# EAGLE schematic full_board (EAGLE 7.4.0)
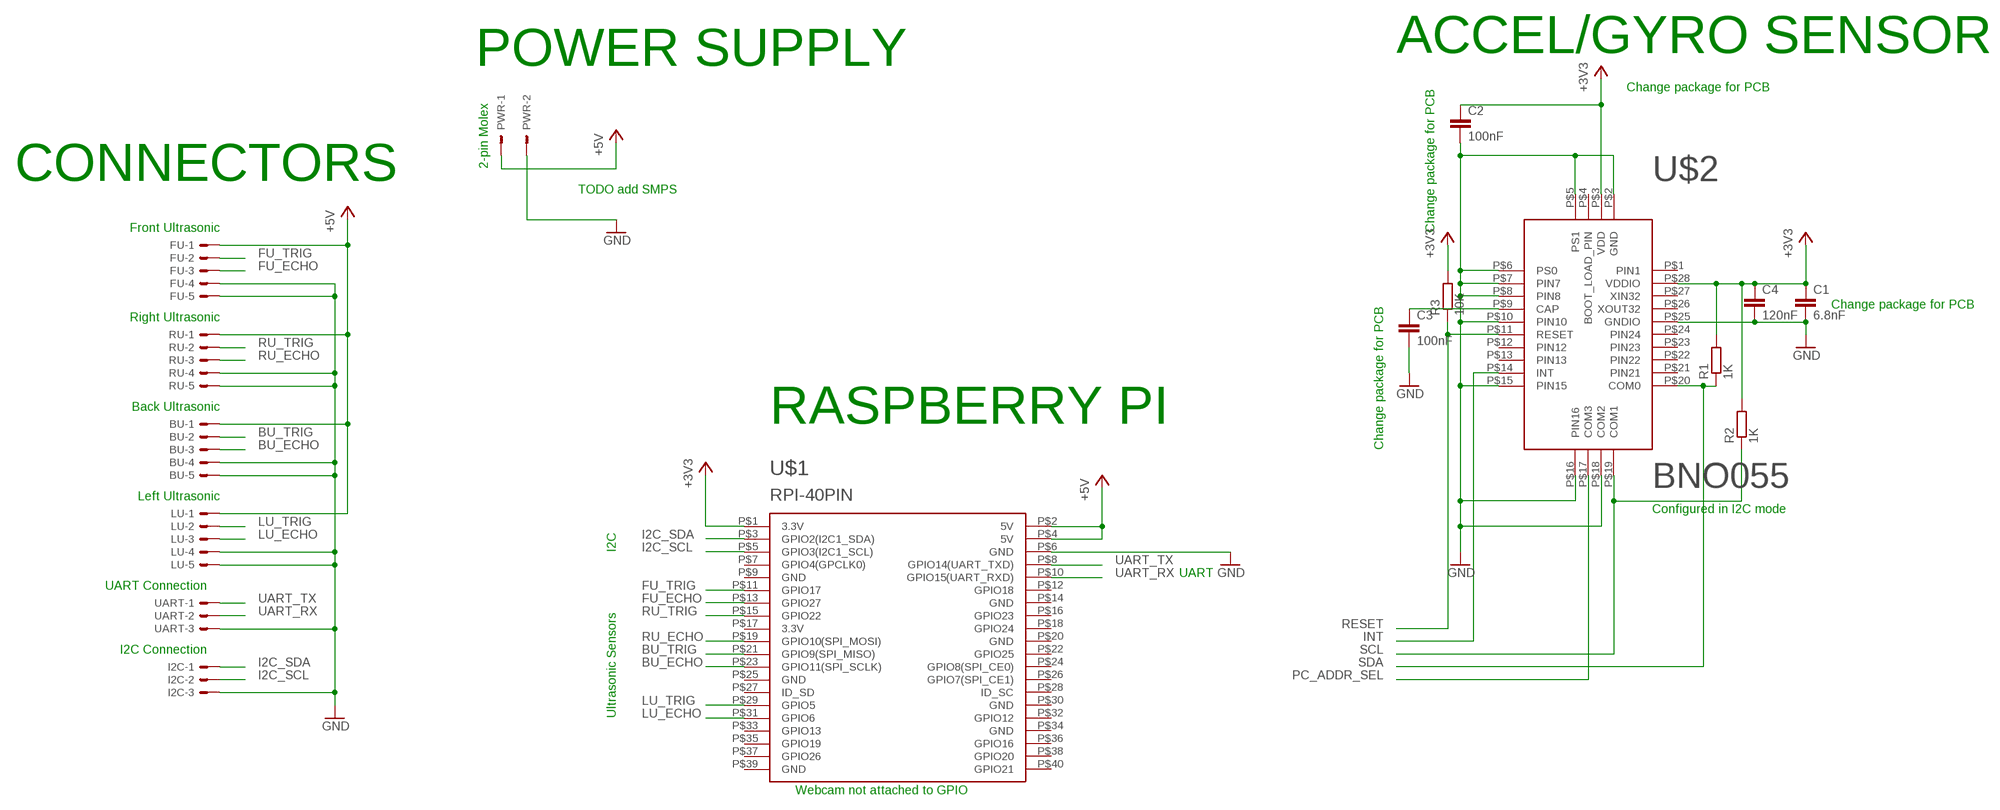
[diagram p0: schematic, sheet 1]

## Parts
BU  KK-156-5  [KK-156-5]
C1  6.8nF  C-EUC0805  [C0805]
C2  100nF  C-EUC0805  [C0805]
C3  100nF  C-EUC0805  [C0805]
C4  120nF  C-EUC0805  [C0805]
FU  KK-156-5  [KK-156-5]
I2C  KK-156-3  [KK-156-3]
LU  KK-156-5  [KK-156-5]
PWR  KK-156-2  [KK-156-2]
R1  1K  R-EU_0204/7  [0204/7]
R2  1K  R-EU_0204/7  [0204/7]
R3  10K  R-EU_0204/7  [0204/7]
RU  KK-156-5  [KK-156-5]
U$1  RPI-40PIN  [RPI-40PIN]
U$2  BNO055  [LGA-28]
UART  KK-156-3  [KK-156-3]

## Nets
+3V3: C1.1 C2.1 C4.1 R1.2 R2.2 R3.2 U$1.P$1(3.3V) U$2.P$3(VDD) U$2.P$28(VDDIO)
+5V: BU.1 FU.1 LU.1 PWR.1 RU.1 U$1.P$2(5V) U$1.P$4(5V)
BU_ECHO: BU.3 U$1.P$23(GPIO11(SPI_SCLK))
BU_TRIG: BU.2 U$1.P$21(GPIO9(SPI_MISO))
FU_ECHO: FU.3 U$1.P$13(GPIO27)
FU_TRIG: FU.2 U$1.P$11(GPIO17)
GND: BU.4 BU.5 C1.2 C2.2 C3.2 C4.2 FU.4 FU.5 I2C.3 LU.4 LU.5 PWR.2 RU.4 RU.5 U$1.P$6(GND) U$2.P$2(GND) U$2.P$5(PS1) U$2.P$6(PS0) U$2.P$7(PIN7) U$2.P$8(PIN8) U$2.P$10(PIN10) U$2.P$15(PIN15) U$2.P$16(PIN16) U$2.P$18(COM2) U$2.P$25(GNDIO) UART.3
I2C_SCL: I2C.2 U$1.P$5(GPIO3(I2C1_SCL))
I2C_SDA: I2C.1 U$1.P$3(GPIO2(I2C1_SDA))
INT: U$2.P$14(INT)
LU_ECHO: LU.3 U$1.P$31(GPIO6)
LU_TRIG: LU.2 U$1.P$29(GPIO5)
N$4: C3.1 U$2.P$9(CAP)
PC_ADDR_SEL: U$2.P$17(COM3)
RESET: R3.1 U$2.P$11(RESET)
RU_ECHO: RU.3 U$1.P$19(GPIO10(SPI_MOSI))
RU_TRIG: RU.2 U$1.P$15(GPIO22)
SCL: R2.1 U$2.P$19(COM1)
SDA: R1.1 U$2.P$20(COM0)
UART_RX: U$1.P$10(GPIO15(UART_RXD)) UART.2
UART_TX: U$1.P$8(GPIO14(UART_TXD)) UART.1
Unconnected: U$1.P$7(GPIO4(GPCLK0)) U$1.P$12(GPIO18) U$1.P$16(GPIO23) U$1.P$18(GPIO24) U$1.P$22(GPIO25) U$1.P$24(GPIO8(SPI_CE0)) U$1.P$26(GPIO7(SPI_CE1)) U$1.P$27(ID_SD) U$1.P$28(ID_SC) U$1.P$32(GPIO12) U$1.P$33(GPIO13) U$1.P$35(GPIO19) U$1.P$36(GPIO16) U$1.P$37(GPIO26) U$1.P$38(GPIO20) U$1.P$40(GPIO21) U$2.P$1(PIN1) U$2.P$4(BOOT_LOAD_PIN) U$2.P$12(PIN12) U$2.P$13(PIN13) U$2.P$21(PIN21) U$2.P$22(PIN22) U$2.P$23(PIN23) U$2.P$24(PIN24) U$2.P$26(XOUT32) U$2.P$27(XIN32)

## Notes on the sheet
- POWER SUPPLY | ACCEL/GYRO SENSOR
- Change package for PCB
- 2-pin Molex
- CONNECTORS
- TODO add SMPS
- Front Ultrasonic | Change package for PCB
- Change package for PCB
- Right Ultrasonic
- Back Ultrasonic
- RASPBERRY PI
- Change package for PCB
- Left Ultrasonic
- Configured in I2C mode
- I2C
- UART
- UART Connection
- I2C Connection
- Ultrasonic Sensors
- Webcam not attached to GPIO

## Power pins joined to a net without a drawn wire
3.3V: U$1.P$17(3.3V)
GND: U$1.P$9(GND) U$1.P$14(GND) U$1.P$20(GND) U$1.P$25(GND) U$1.P$30(GND) U$1.P$34(GND) U$1.P$39(GND)

## Library data of the parts
BU FU LU RU = con-molex:KK-156-5: KK 156 HEADER Source: http://www.molex.com/pdm_docs/sd/026604100_sd.pdf; OC_FARNELL: unknown; OC_NEWARK: unknown; OC_RS: 173-2950
C1-C4 = rcl:C-EU: CAPACITOR, European symbol; OC_RS: 723-6310
I2C UART = con-molex:KK-156-3: KK 156 HEADER Source: http://www.molex.com/pdm_docs/sd/026604100_sd.pdf; OC_FARNELL: unknown; OC_NEWARK: unknown; OC_RS: 173-2922
PWR = con-molex:KK-156-2: KK 156 HEADER Source: http://www.molex.com/pdm_docs/sd/026604100_sd.pdf; OC_FARNELL: unknown; OC_NEWARK: unknown; OC_RS: 173-2916
R1-R3 = rcl:R-EU_: RESISTOR, European symbol
U$1 = RPiBreakout:RPI-40PIN: 40-pin socket for Raspberry Pi v2 See link for pinout: Click Here <http://www.rs-online.com/designspark/electronics/eng/blog/introducing-the-raspberry-pi-b-plus>
U$2 = sensor:BNO055: 28-pin LGA-28 9-Axis Accelerometer, Gyroscope & Magnetometer BNO055 package See links: RS <http://uk.rs-online.com/web/p/accelerometer-ics/8496171/> Datasheet <http://docs-europe.electrocomponents.com/webdocs/1378/0900766b81378c35.pdf>; OC_RS: 849-6171